# EAGLE schematic AUX power board (V3.4) (EAGLE 7.5.0)
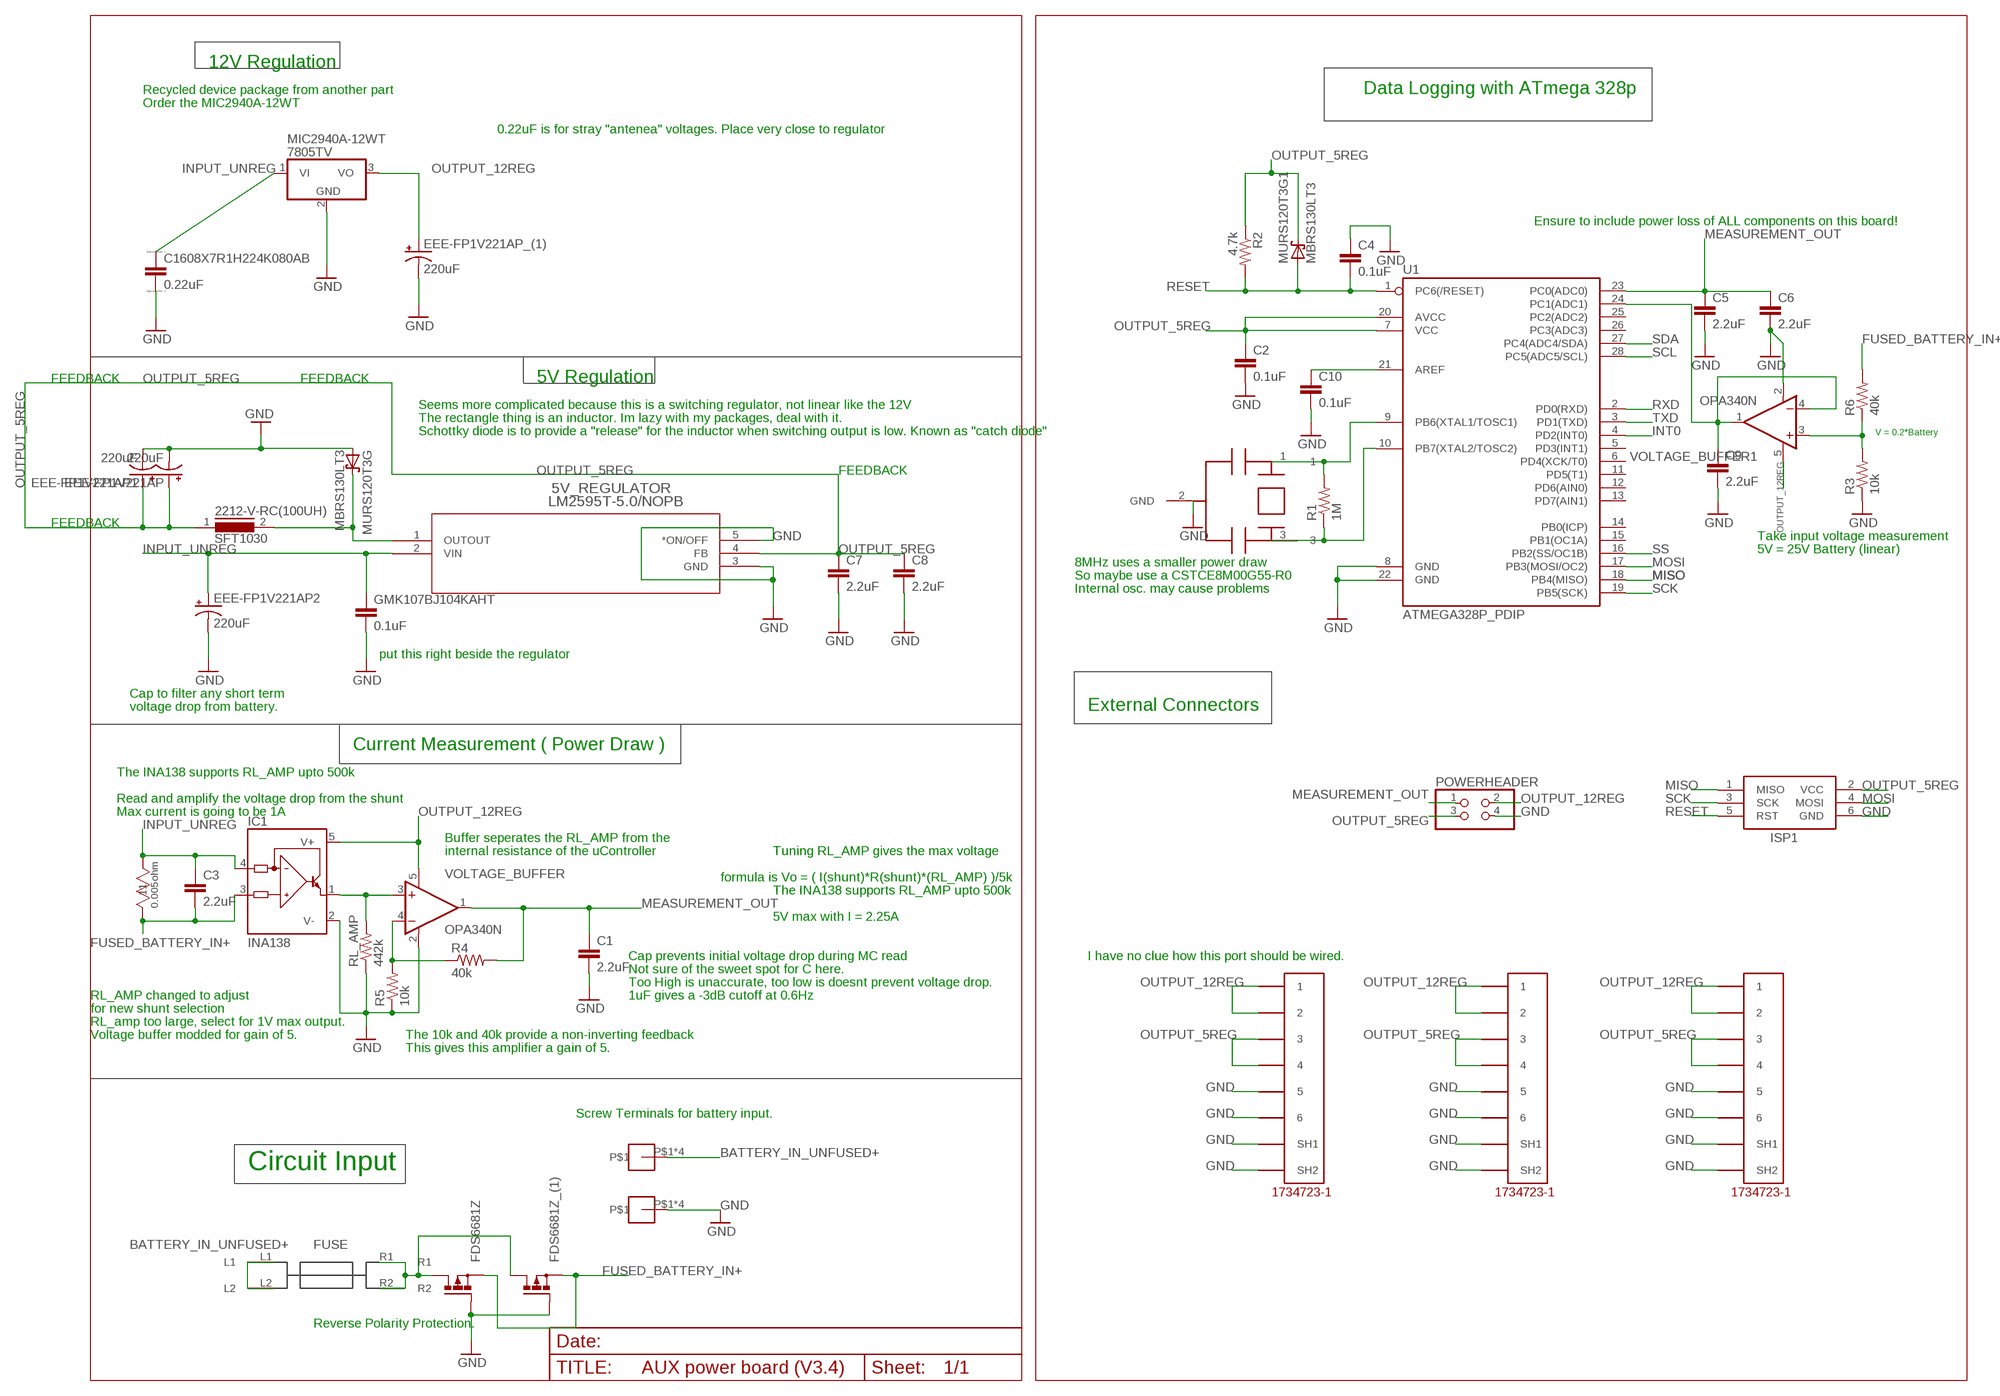
[diagram p0: schematic, sheet 1]

## Parts
5V_REGULATOR  LM2595T-5.0/NOPB  [T05D]
15FR005E  15FR005E  [RES_15]
2212-V-RC(100UH)  SFT1030  [SFT1030]
C1  2.2uF  C-EUC0603  [C0603]
C2  0.1uF  C-EUC0603  [C0603]
C3  2.2uF  C-EUC0603  [C0603]
C4  0.1uF  C-EUC0603  [C0603]
C5  2.2uF  C-EUC0603  [C0603]
C6  2.2uF  C-EUC0603  [C0603]
C7  2.2uF  C-EUC0603  [C0603]
C8  2.2uF  C-EUC0603  [C0603]
C9  2.2uF  C-EUC0603  [C0603]
C10  0.1uF  C-EUC0603  [C0603]
C1608X7R1H224K080AB  0.22uF  CC0603  [C0603]
CSTCE8M00G55-R0  CSTCE16M0V53-R0  [RESONATOR]
EEE-FP1V221AP  220uF  CPOL-US175TMP-0808  [175TMP-0808]
EEE-FP1V221AP1  220uF  CPOL-US175TMP-0808  [175TMP-0808]
EEE-FP1V221AP2  220uF  CPOL-US175TMP-0808  [175TMP-0808]
EEE-FP1V221AP_(1)  220uF  CPOL-US175TMP-0808  [175TMP-0808]
FDS6681Z  P-MOSFET-SO8  [SO-08]
FDS6681Z_(1)  P-MOSFET-SO8  [SO-08]
GMK107BJ104KAHT  0.1uF  C-EUC0603  [C0603]
IC1  INA138  [SOT23-5]
ISP1  AVRISP-6  [AVRISP]
MIC2940A-12WT  7805TV  [TO220V]
MINIBLADE  3568  [3568]
MURS120T3G  MBRS130LT3  [SMB]
MURS120T3G1  MBRS130LT3  [SMB]
POWERHEADER  PINHD-2X2  [2X02]
R1  1M  R-US_R0603  [R0603]
R2  4.7k  R-US_R0603  [R0603]
R3  10k  R-US_R0603  [R0603]
R4  40k  R-US_R0603  [R0603]
R5  10k  R-US_R0603  [R0603]
R6  40k  R-US_R0603  [R0603]
RL_AMP  442k  R-US_R0603  [R0603]
U1  ATMEGA328P_PDIP  [DIL28-3]
U$3  5555140-6  [1734723-1_RJ11]
U$4  5555140-6  [1734723-1_RJ11]
U$5  5555140-6  [1734723-1_RJ11]
U$6  SCREW-8191  [SCREW-8191]
U$7  SCREW-8191  [SCREW-8191]
VOLTAGE_BUFFER  OPA340N  [SOT23-5]
VOLTAGE_BUFFER1  OPA340N  [SOT23-5]

## Nets
BATTERY_IN_UNFUSED+: MINIBLADE.L1 MINIBLADE.L2 U$6.P$1 U$6.P$2 U$6.P$3 U$6.P$4
FUSED_BATTERY_IN+: 15FR005E.1 C3.2 FDS6681Z.1(S) FDS6681Z.2(S) FDS6681Z.3(S) FDS6681Z_(1).1(S) FDS6681Z_(1).2(S) FDS6681Z_(1).3(S) IC1.3(IN+) R6.2
GND: 5V_REGULATOR.3(GND) 5V_REGULATOR.5(*ON/OFF) C1.2 C2.2 C4.1 C5.2 C6.2 C7.2 C8.2 C9.2 C10.2 C1608X7R1H224K080AB.2 CSTCE8M00G55-R0.2(GND) EEE-FP1V221AP1.- EEE-FP1V221AP2.- EEE-FP1V221AP.- EEE-FP1V221AP_(1).- FDS6681Z.4(G) FDS6681Z_(1).4(G) GMK107BJ104KAHT.2 IC1.2(V-) ISP1.6(GND) MIC2940A-12WT.2(GND) MURS120T3G.A POWERHEADER.4 R3.1 R5.1 RL_AMP.1 U1.8(GND) U1.22(GND) U$3.5 U$3.6 U$3.SH1 U$3.SH2 U$4.5 U$4.6 U$4.SH1 U$4.SH2 U$5.5 U$5.6 U$5.SH1 U$5.SH2 U$7.P$1 U$7.P$2 U$7.P$3 U$7.P$4 VOLTAGE_BUFFER1.2(V-) VOLTAGE_BUFFER.2(V-)
INPUT_UNREG: 5V_REGULATOR.2(VIN) 15FR005E.2 C3.1 C1608X7R1H224K080AB.1 EEE-FP1V221AP2.+ GMK107BJ104KAHT.1 IC1.4(IN-) MIC2940A-12WT.1(VI)
INT0: U1.4(PD2(INT0))
MEASUREMENT_OUT: C1.1 C5.1 C6.1 POWERHEADER.1 R4.2 U1.23(PC0(ADC0)) VOLTAGE_BUFFER.1(OUT)
MISO: ISP1.1(MISO) U1.18(PB4(MISO))
MMM: FDS6681Z.5(D) FDS6681Z.6(D) FDS6681Z.7(D) FDS6681Z.8(D) FDS6681Z_(1).5(D) FDS6681Z_(1).6(D) FDS6681Z_(1).7(D) FDS6681Z_(1).8(D) MINIBLADE.R1 MINIBLADE.R2
MOSI: ISP1.4(MOSI) U1.17(PB3(MOSI/OC2))
N$1: 5V_REGULATOR.1(OUTOUT) 2212-V-RC(100UH).2 MURS120T3G.C
N$2: R4.1 R5.2 VOLTAGE_BUFFER.4(-IN)
N$3: IC1.1(OUT) RL_AMP.2 VOLTAGE_BUFFER.3(+IN)
N$11: C9.1 U1.24(PC1(ADC1)) VOLTAGE_BUFFER1.1(OUT) VOLTAGE_BUFFER1.4(-IN)
N$12: R3.2 R6.1 VOLTAGE_BUFFER1.3(+IN)
N$14: C10.1 U1.21(AREF)
N$18: CSTCE8M00G55-R0.1 R1.2 U1.9(PB6(XTAL1/TOSC1))
N$19: CSTCE8M00G55-R0.3 R1.1 U1.10(PB7(XTAL2/TOSC2))
OUTPUT_5REG: 5V_REGULATOR.4(FB) 2212-V-RC(100UH).1 C2.1 C7.1 C8.1 EEE-FP1V221AP1.+ EEE-FP1V221AP.+ ISP1.2(VCC) MURS120T3G1.C POWERHEADER.3 R2.1 U1.7(VCC) U1.20(AVCC) U$3.3 U$3.4 U$4.3 U$4.4 U$5.3 U$5.4
OUTPUT_12REG: EEE-FP1V221AP_(1).+ IC1.5(V+) MIC2940A-12WT.3(VO) POWERHEADER.2 U$3.1 U$3.2 U$4.1 U$4.2 U$5.1 U$5.2 VOLTAGE_BUFFER1.5(V+) VOLTAGE_BUFFER.5(V+)
RESET: C4.2 ISP1.5(RST) MURS120T3G1.A R2.2 U1.1(PC6(/RESET))
RXD: U1.2(PD0(RXD))
SCK: ISP1.3(SCK) U1.19(PB5(SCK))
SCL: U1.28(PC5(ADC5/SCL))
SDA: U1.27(PC4(ADC4/SDA))
SS: U1.16(PB2(SS/OC1B))
TXD: U1.3(PD1(TXD))
Unconnected: U1.5(PD3(INT1)) U1.6(PD4(XCK/T0)) U1.11(PD5(T1)) U1.12(PD6(AIN0)) U1.13(PD7(AIN1)) U1.14(PB0(ICP)) U1.15(PB1(OC1A)) U1.25(PC2(ADC2)) U1.26(PC3(ADC3))

## Notes on the sheet
- 12V Regulation
- Recycled device package from another part | Data Logging with ATmega 328p
- Order the MIC2940A-12WT
- 0.22uF is for stray "antenea" voltages. Place very close to regulator
- Ensure to include power loss of ALL components on this board!
- FEEDBACK | FEEDBACK | 5V Regulation
- Seems more complicated because this is a switching regulator, not linear like the 12V
- The rectangle thing is an inductor. Im lazy with my packages, deal with it.
- Schottky diode is to provide a "release" for the inductor when switching output is low. Known as "catch diode" | V = 0.2*Battery
- FEEDBACK
- FEEDBACK
- Take input voltage measurement
- 5V = 25V Battery (linear)
- 8MHz uses a smaller power draw
- So maybe use a CSTCE8M00G55-R0
- Internal osc. may cause problems
- put this right beside the regulator
- Cap to filter any short term
- voltage drop from battery. | External Connectors
- Current Measurement ( Power Draw )
- The INA138 supports RL_AMP upto 500k
- Read and amplify the voltage drop from the shunt
- Max current is going to be 1A
- Buffer seperates the RL_AMP from the
- internal resistance of the uController | Tuning RL_AMP gives the max voltage
- formula is Vo = ( I(shunt)*R(shunt)*(RL_AMP) )/5k
- The INA138 supports RL_AMP upto 500k
- 5V max with I = 2.25A
- Cap prevents initial voltage drop during MC read | I have no clue how this port should be wired.
- Not sure of the sweet spot for C here.
- Too High is unaccurate, too low is doesnt prevent voltage drop.
- RL_AMP changed to adjust | 1uF gives a -3dB cutoff at 0.6Hz
- for new shunt selection
- RL_amp too large, select for 1V max output.
- Voltage buffer modded for gain of 5. | The 10k and 40k provide a non-inverting feedback
- This gives this amplifier a gain of 5.
- Screw Terminals for battery input.
- Circuit Input
- Reverse Polarity Protection.

## Library data of the parts
5V_REGULATOR = LM2595T-5:LM2595T-5.0/NOPB; COPYRIGHT: Copyright C 2015 Accelerated Designs. All rights reserved; MANUFACTURER_PART_NUMBER: LM2595T50; VENDOR: National Semiconductor
15FR005E = 15FR005E:15FR005E; COPYRIGHT: Copyright C 2015 Accelerated Designs. All rights reserved; MANUFACTURER_PART_NUMBER: 15FR005E; VENDOR: Ohmite
2212-V-RC(100UH) = inductors:SFT1030: INDUCTOR
C1 C2 C10 = resistor:C-EU: CAPACITOR, European symbol
C3-C9 GMK107BJ104KAHT = rcl:C-EU: CAPACITOR, European symbol
C1608X7R1H224K080AB = eagle-ltspice:C: CAPACITOR, European symbol; SPICEMODEL: NONE; SPICEPREFIX: C
CSTCE8M00G55-R0 = arduino_Uno_Rev3-02-TH:CSTCE16M0V53-R0
EEE-FP1V221AP EEE-FP1V221AP1 EEE-FP1V221AP2 EEE-FP1V221AP_(1) = rcl:CPOL-US: POLARIZED CAPACITOR, American symbol
FDS6681Z FDS6681Z_(1) = transistor-power:P-MOSFET-SO8: P-Channel MOSFET Example: FDS4435A; P-Channel Logic Level PowerTrench® MOSFET FDS4465; P-Channel 1.8V Specified PowerTrench® MOSFET Source: www.fairchildsemi.com
IC1 = burr-brown:INA138: High-Side Measurement Current Shunt Monitor; MF: TEXAS INSTRUMENTS; MPN: INA138NA/250; OC_FARNELL: 1564888; OC_NEWARK: 80K5906
ISP1 = adafruit:AVRISP: AVR ISP HEADER Standard 6 pin header for AVR programming
MIC2940A-12WT = linear:78*: Positive VOLTAGE REGULATOR Source: http://cache.national.com/ds/LM/LM78L05.pdf http://www.fairchildsemi.com/ds/LM/LM7805.pdf
MINIBLADE = fuse:3568
MURS120T3G MURS120T3G1 = diode:MBRS130LT3: Schottky Power Rectifier Source: http://www.onsemi.com/pub/Collateral/MBRS130LT3-D.PDF
POWERHEADER = pinhead:PINHD-2X2: PIN HEADER
R1 = rcl:R-US_: RESISTOR, American symbol
R2-R6 RL_AMP = resistor:R-US_: RESISTOR, American symbol
U1 = SparkFun-DigitalIC:ATMEGA328P_PDIP: uC used in the Arduino 32kb flash, 1k EEPROM, 2k SRAM This is the through-hole version of this chip.
U$3-U$5 = 5555140-6 RJ11:5555140-6
U$6 U$7 = Shell2013:SCREW-8191
VOLTAGE_BUFFER VOLTAGE_BUFFER1 = burr-brown:OPA340: Rail-to-Rail Operational Amplifiers Single-Supply, MicroAmplifier(TM) Series; MPN: OPA340NA/3KG4; OC_FARNELL: 1234805; OC_NEWARK: 13M5177